# EAGLE board Daughter Card v5 (EAGLE 7.7.0)
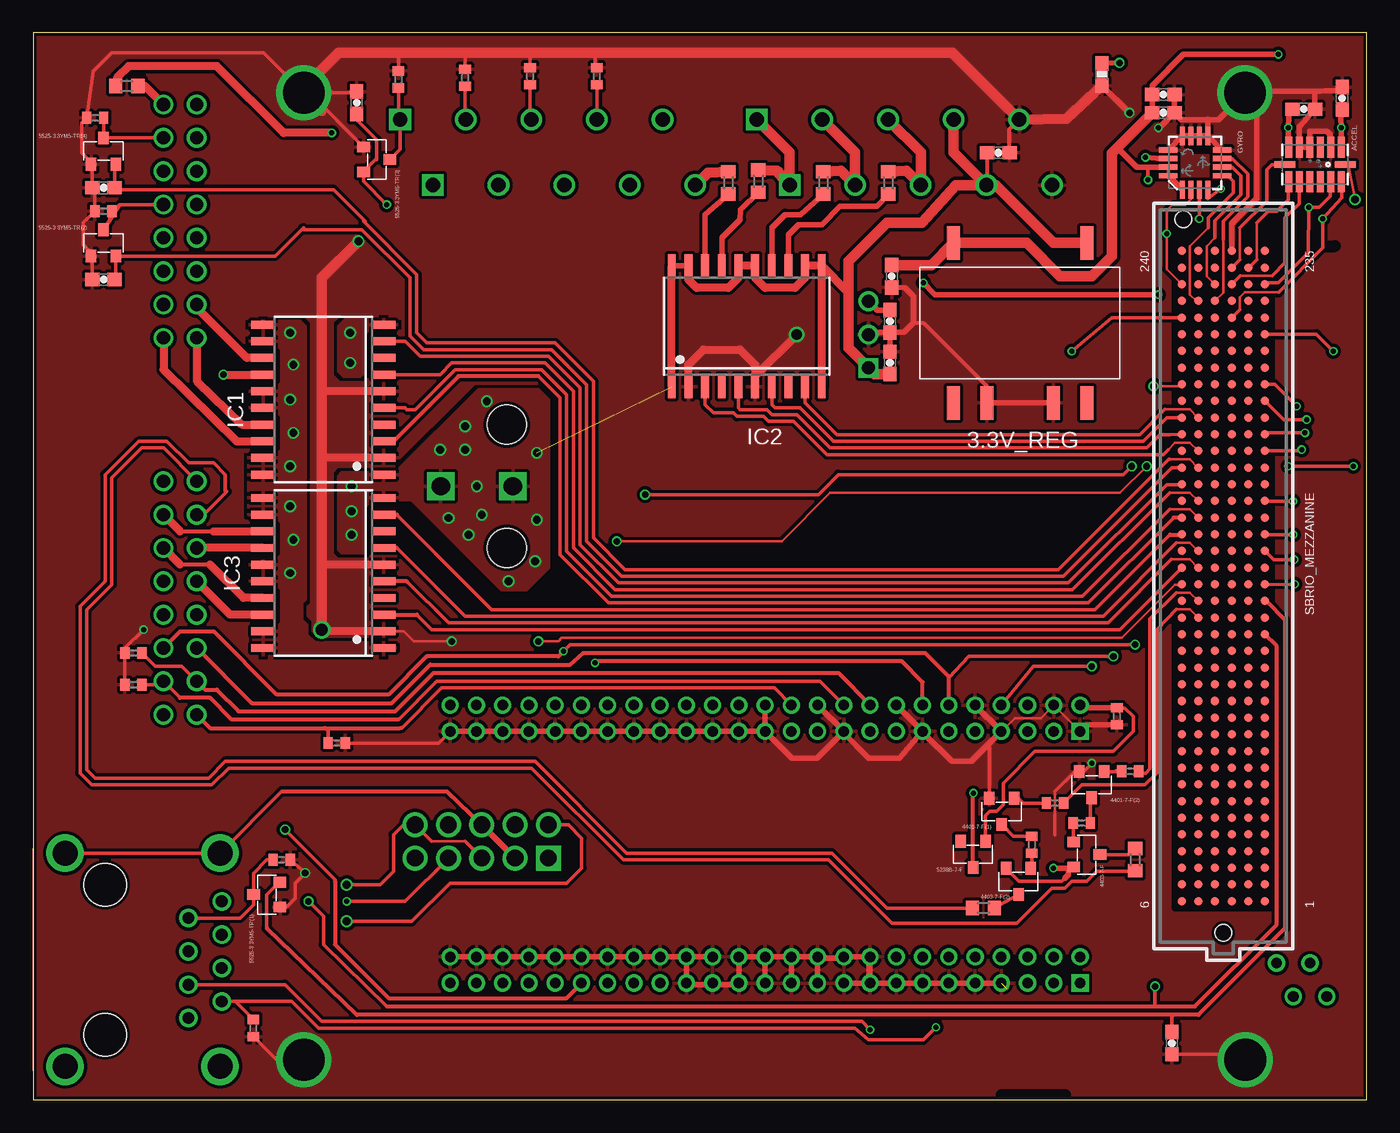
[diagram p2: board, top side]
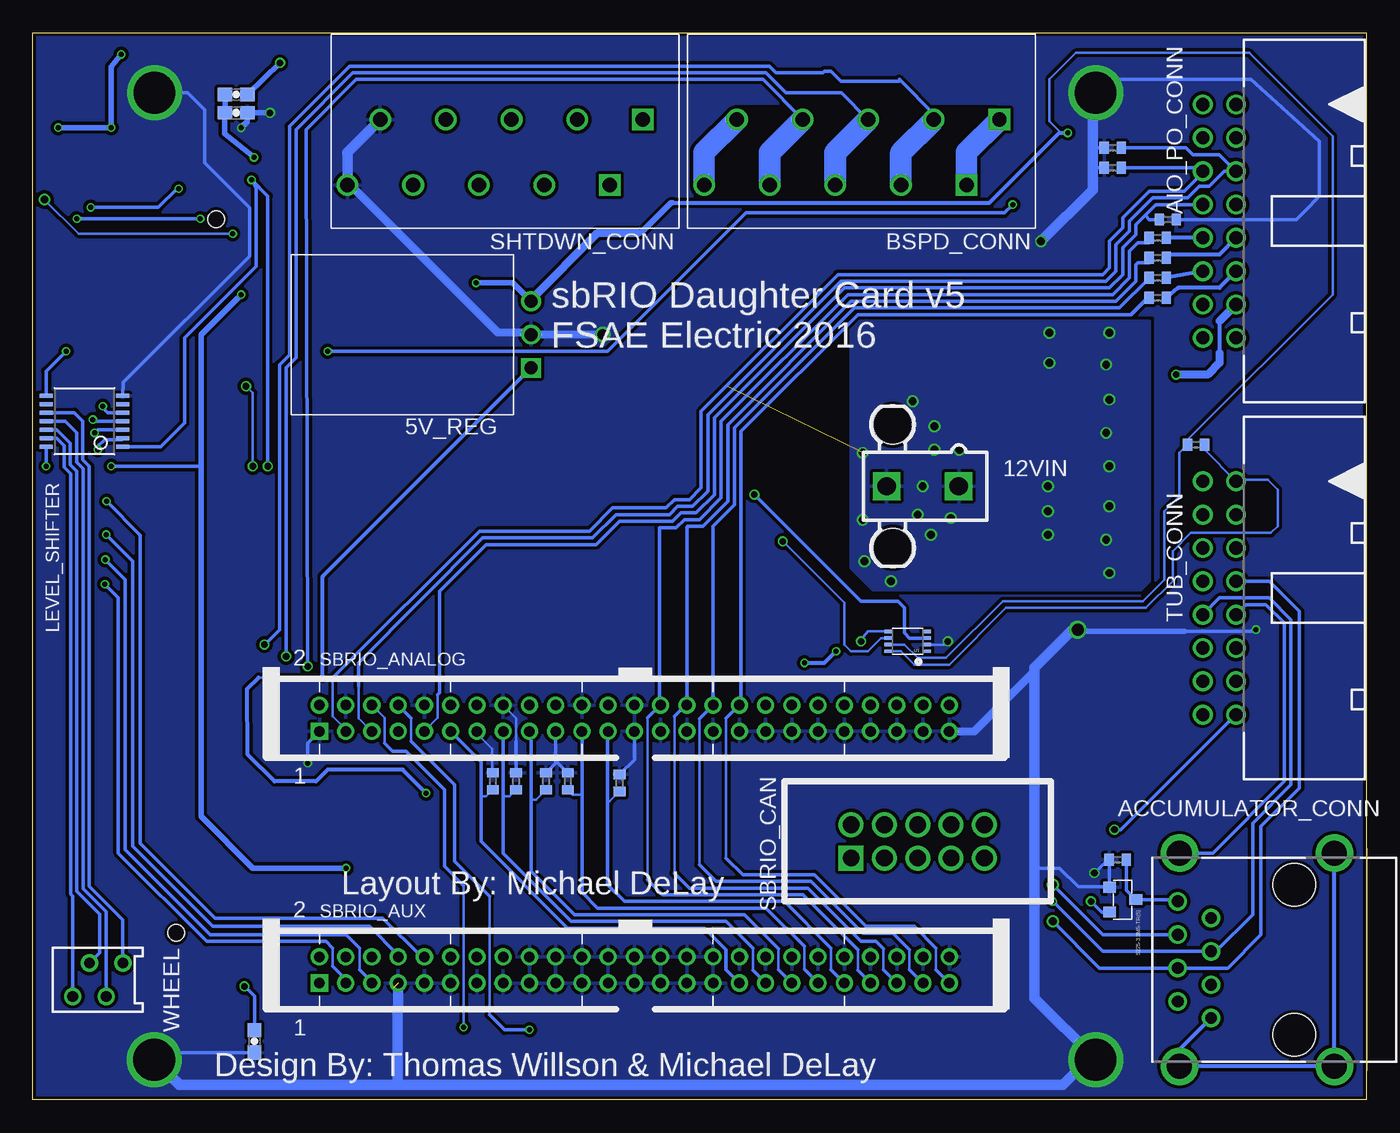
[diagram p3: board, bottom side, seen from below]

Size 101.65 x 81.28 mm. Coordinates in mm from the lower left corner, seen from the top.
Outline: 0.05,0 101.65,0 101.65,81.28 0.05,81.28 0.05,0
Copper layers (1*16): Top 0.035mm / dielectric 1.5mm / Bottom 0.035mm
Design rules "PCBFabExpress DRC": minimum track width 6mil, minimum drill 15mil, track to track 6mil, track to pad 8mil, pad to pad 8mil, via to via 8mil, smd to smd 8mil, copper to edge 10mil, drill to drill 8mil, minimum pad ring 10mil, minimum via ring 5mil, stop-mask expansion 2mil, vias tented up to drill 15mil, thermal gap 10mil
Net classes: 0 default: clearance 0.205 mm
tRestrict: area 87,14.6 to 94.4,65.2; area 65.4,29.6 to 66.3,30.6; area 73.4,27.6 to 74.3,28.5; area 55.3,29.6 to 56.3,30.6; area 59.4,29.6 to 60.4,30.6; 3 lines
bRestrict: area 67.3,27.6 to 68.2,28.5; area 73.4,27.6 to 74.3,28.5; area 61.3,27.6 to 62.3,28.5; 1 lines

## Footprints (pad centres in the part's own frame; a part is rotated, then mirrored left to right if it is on the bottom)
V78XX-1000 = smd 1 x 2.54: 1 -5.08,-6.096; 5 5.08,-6.096; 6 5.08,6.096; 7 2.54,6.096; 9 -2.54,6.096; 10 -5.08,6.096
V78XX-1500R = drill 1 square: P$1 0,2.54 | drill 1: P$2 0,0; P$3 0,-2.54
5566-2 = drill 1.4 square: 1 0,-2.75; 2 0,2.75 | hole 3: 4.7,2.29; -4.7,2.29
SOT-23-3 = smd 0.8 x 0.976: P$1 0,1; P$2 -0.95,-1; P$3 0.95,-1
LGA14 = smd 0.5 x 1.6: 1 2,1.3; 2 1.2,1.3; 3 0.4,1.3; 4 -0.4,1.3; 5 -1.2,1.3; 6 -2,1.3; 8 -2,-1.3; 9 -1.2,-1.3; 10 -0.4,-1.3; 11 0.4,-1.3; 12 1.2,-1.3; 13 2,-1.3 | smd 1.6 x 0.5: 7 -2.3,0; 14 2.3,0
RJ45-SHIELD1 = drill 0.9 pad 1.4: 1 -4.445,6.35; 2 -3.175,8.89; 3 -1.905,6.35; 4 -0.635,8.89; 5 0.635,6.35; 6 1.905,8.89; 7 3.175,6.35; 8 4.445,8.89 | drill 1.9 pad 2.5: S1 -8.128,-3.048; S2 8.128,-3.048; S3 -8.128,8.76; S4 8.128,8.76 | hole 3.251: -5.715,0; 5.715,0
PAK100/2500-5-16 = drill 1 pad 1.422: 1 -8.89,-1.27; 2 -8.89,1.27; 3 -6.35,-1.27; 4 -6.35,1.27; 5 -3.81,-1.27; 6 -3.81,1.27; 7 -1.27,-1.27; 8 -1.27,1.27; 9 1.27,-1.27; 10 1.27,1.27; 11 3.81,-1.27; 12 3.81,1.27; 13 6.35,-1.27; 14 6.35,1.27; 15 8.89,-1.27; 16 8.89,1.27
CONNECTOR_5 = drill 1.1 square: 1 0,0; 2 2.5,5 | drill 1.1: 3 5,0; 4 7.5,5; 5 10,0; 6 12.5,5; 7 15,0; 8 17.5,5; 9 20,0; 10 22.5,5
0603-CAP = smd 1.1 x 1: 1 -0.85,0; 2 0.85,0
R0603 = smd 1 x 1.1: 1 -0.85,0; 2 0.85,0
R0402 = smd 0.7 x 0.9: 1 -0.65,0; 2 0.65,0
LGA16-4X4 = smd 1.4 x 0.4: 1 -2.05,0.975; 2 -2.05,0.325; 3 -2.05,-0.325; 4 -2.05,-0.975; 9 2.05,-0.975; 10 2.05,-0.325; 11 2.05,0.325; 12 2.05,0.975 | smd 0.4 x 1.4: 5 -0.975,-2.05; 6 -0.325,-2.05; 7 0.325,-2.05; 8 0.975,-2.05; 13 0.975,2.05; 14 0.325,2.05; 15 -0.325,2.05; 16 -0.975,2.05
PG-DSO-20 = smd 0.6 x 1.8: 1 -5.715,-4.6; 2 -4.445,-4.6; 3 -3.175,-4.6; 4 -1.905,-4.6; 5 -0.635,-4.6; 6 0.635,-4.6; 7 1.905,-4.6; 8 3.175,-4.6; 9 4.445,-4.6; 10 5.715,-4.6; 11 5.715,4.6; 12 4.445,4.6; 13 3.175,4.6; 14 1.905,4.6; 15 0.635,4.6; 16 -0.635,4.6; 17 -1.905,4.6; 18 -3.175,4.6; 19 -4.445,4.6; 20 -5.715,4.6
TSSOP14 = smd 0.305 x 0.991: 1 -1.95,-2.918; 2 -1.3,-2.918; 3 -0.65,-2.918; 4 0,-2.918; 5 0.65,-2.918; 6 1.3,-2.918; 7 1.95,-2.918; 8 1.95,2.918; 9 1.3,2.918; 10 0.65,2.918; 11 0,2.918; 12 -0.65,2.918; 13 -1.3,2.918; 14 -1.95,2.918
0603-RES = smd 1.1 x 1: 1 -0.85,0; 2 0.85,0
SBRIO_J502_J503 = drill 0.8 square: P$1 0,0 | drill 0.8: P$2 0,2; P$3 2,0; P$4 2,2; P$5 4,0; P$6 4,2; P$7 6,0; P$8 6,2; P$9 8,0; P$10 8,2; P$11 10,0; P$12 10,2; P$13 12,0; P$14 12,2; P$15 14,0; P$16 14,2; P$17 16,0; P$18 16,2; P$19 18,0; P$20 18,2; P$21 20,0; P$22 20,2; P$23 22,0; P$24 22,2; P$25 24,0; P$26 24,2; P$27 26,0; P$28 26,2; P$29 28,0; P$30 28,2; P$31 30,0; P$32 30,2; P$33 32,0; P$34 32,2; P$35 34,0; P$36 34,2; P$37 36,0; P$38 36,2; P$39 38,0; P$40 38,2; P$41 40,0; P$42 40,2; P$43 42,0; P$44 42,2; P$45 44,0; P$46 44,2; P$47 46,0; P$48 46,2; P$49 48,0; P$50 48,2
SBRIO_W = drill 1.27 pad 1.778 square: P$1 -5.08,-1.27 | drill 1.27 pad 1.778: P$2 -5.08,1.27; P$3 -2.54,-1.27; P$4 -2.54,1.27; P$5 0,-1.27; P$6 0,1.27; P$7 2.54,-1.27; P$8 2.54,1.27; P$9 5.08,-1.27; P$10 5.08,1.27
SEAM-40-XX.X-XX-06-X-A = smd 0.635 x 0.635: 1 24.765,3.175; 2 24.765,1.905; 3 24.765,0.635; 4 24.765,-0.635; 5 24.765,-1.905; 6 24.765,-3.175; 7 23.495,3.175; 8 23.495,1.905; 9 23.495,0.635; 10 23.495,-0.635; 11 23.495,-1.905; 12 23.495,-3.175; 13 22.225,3.175; 14 22.225,1.905; 15 22.225,0.635; 16 22.225,-0.635; 17 22.225,-1.905; 18 22.225,-3.175; 19 20.955,3.175; 20 20.955,1.905; 21 20.955,0.635; 22 20.955,-0.635; 23 20.955,-1.905; 24 20.955,-3.175; 25 19.685,3.175; 26 19.685,1.905; 27 19.685,0.635; 28 19.685,-0.635; 29 19.685,-1.905; 30 19.685,-3.175; 31 18.415,3.175; 32 18.415,1.905; 33 18.415,0.635; 34 18.415,-0.635; 35 18.415,-1.905; 36 18.415,-3.175; 37 17.145,3.175; 38 17.145,1.905; 39 17.145,0.635; 40 17.145,-0.635; 41 17.145,-1.905; 42 17.145,-3.175; 43 15.875,3.175; 44 15.875,1.905; 45 15.875,0.635; 46 15.875,-0.635; 47 15.875,-1.905; 48 15.875,-3.175; 49 14.605,3.175; 50 14.605,1.905; 51 14.605,0.635; 52 14.605,-0.635; 53 14.605,-1.905; 54 14.605,-3.175; 55 13.335,3.175; 56 13.335,1.905; 57 13.335,0.635; 58 13.335,-0.635; 59 13.335,-1.905; 60 13.335,-3.175; 61 12.065,3.175; 62 12.065,1.905; 63 12.065,0.635; 64 12.065,-0.635; 65 12.065,-1.905; 66 12.065,-3.175; 67 10.795,3.175; 68 10.795,1.905; 69 10.795,0.635; 70 10.795,-0.635; 71 10.795,-1.905; 72 10.795,-3.175; 73 9.525,3.175; 74 9.525,1.905; 75 9.525,0.635; 76 9.525,-0.635; 77 9.525,-1.905; 78 9.525,-3.175; 79 8.255,3.175; 80 8.255,1.905; 81 8.255,0.635; 82 8.255,-0.635; 83 8.255,-1.905; 84 8.255,-3.175; 85 6.985,3.175; 86 6.985,1.905; 87 6.985,0.635; 88 6.985,-0.635; 89 6.985,-1.905; 90 6.985,-3.175; 91 5.715,3.175; 92 5.715,1.905; 93 5.715,0.635; 94 5.715,-0.635; 95 5.715,-1.905; 96 5.715,-3.175; 97 4.445,3.175; 98 4.445,1.905; 99 4.445,0.635; 100 4.445,-0.635; 101 4.445,-1.905; 102 4.445,-3.175; 103 3.175,3.175; 104 3.175,1.905; 105 3.175,0.635; 106 3.175,-0.635; 107 3.175,-1.905; 108 3.175,-3.175; 109 1.905,3.175; 110 1.905,1.905; 111 1.905,0.635; 112 1.905,-0.635; 113 1.905,-1.905; 114 1.905,-3.175; 115 0.635,3.175; 116 0.635,1.905; 117 0.635,0.635; 118 0.635,-0.635; 119 0.635,-1.905; 120 0.635,-3.175; 121 -0.635,3.175; 122 -0.635,1.905; 123 -0.635,0.635; 124 -0.635,-0.635; 125 -0.635,-1.905; 126 -0.635,-3.175; 127 -1.905,3.175; 128 -1.905,1.905; 129 -1.905,0.635; 130 -1.905,-0.635; 131 -1.905,-1.905; 132 -1.905,-3.175; 133 -3.175,3.175; 134 -3.175,1.905; 135 -3.175,0.635; 136 -3.175,-0.635; 137 -3.175,-1.905; 138 -3.175,-3.175; 139 -4.445,3.175; 140 -4.445,1.905; 141 -4.445,0.635; 142 -4.445,-0.635; 143 -4.445,-1.905; 144 -4.445,-3.175; 145 -5.715,3.175; 146 -5.715,1.905; 147 -5.715,0.635; 148 -5.715,-0.635; 149 -5.715,-1.905; 150 -5.715,-3.175; 151 -6.985,3.175; 152 -6.985,1.905; 153 -6.985,0.635; 154 -6.985,-0.635; 155 -6.985,-1.905; 156 -6.985,-3.175; 157 -8.255,3.175; 158 -8.255,1.905; 159 -8.255,0.635; 160 -8.255,-0.635; 161 -8.255,-1.905; 162 -8.255,-3.175; 163 -9.525,3.175; 164 -9.525,1.905; 165 -9.525,0.635; 166 -9.525,-0.635; 167 -9.525,-1.905; 168 -9.525,-3.175; 169 -10.795,3.175; 170 -10.795,1.905; 171 -10.795,0.635; 172 -10.795,-0.635; 173 -10.795,-1.905; 174 -10.795,-3.175; 175 -12.065,3.175; 176 -12.065,1.905; 177 -12.065,0.635; 178 -12.065,-0.635; 179 -12.065,-1.905; 180 -12.065,-3.175; 181 -13.335,3.175; 182 -13.335,1.905; 183 -13.335,0.635; 184 -13.335,-0.635; 185 -13.335,-1.905; 186 -13.335,-3.175; 187 -14.605,3.175; 188 -14.605,1.905; 189 -14.605,0.635; 190 -14.605,-0.635; 191 -14.605,-1.905; 192 -14.605,-3.175; 193 -15.875,3.175; 194 -15.875,1.905; 195 -15.875,0.635; 196 -15.875,-0.635; 197 -15.875,-1.905; 198 -15.875,-3.175; 199 -17.145,3.175; 200 -17.145,1.905; 201 -17.145,0.635; 202 -17.145,-0.635; 203 -17.145,-1.905; 204 -17.145,-3.175; 205 -18.415,3.175; 206 -18.415,1.905; 207 -18.415,0.635; 208 -18.415,-0.635; 209 -18.415,-1.905; 210 -18.415,-3.175; 211 -19.685,3.175; 212 -19.685,1.905; 213 -19.685,0.635; 214 -19.685,-0.635; 215 -19.685,-1.905; 216 -19.685,-3.175; 217 -20.955,3.175; 218 -20.955,1.905; 219 -20.955,0.635; 220 -20.955,-0.635; 221 -20.955,-1.905; 222 -20.955,-3.175; 223 -22.225,3.175; 224 -22.225,1.905; 225 -22.225,0.635; 226 -22.225,-0.635; 227 -22.225,-1.905; 228 -22.225,-3.175; 229 -23.495,3.175; 230 -23.495,1.905; 231 -23.495,0.635; 232 -23.495,-0.635; 233 -23.495,-1.905; 234 -23.495,-3.175; 235 -24.765,3.175; 236 -24.765,1.905; 237 -24.765,0.635; 238 -24.765,-0.635; 239 -24.765,-1.905; 240 -24.765,-3.175 | hole 1.27: 27.191,0; -27.191,-3.048
VFSOP-8 = smd 0.25 x 0.65: P$1 -0.75,-1.45; P$2 -0.25,-1.45; P$3 0.25,-1.45; P$4 0.75,-1.45; P$5 0.75,1.45; P$6 0.25,1.45; P$7 -0.25,1.45; P$8 -0.75,1.45
FTOP-4 = drill 0.813: 1 -1.905,-1.27; 2 -0.635,1.27; 3 0.635,-1.27; 4 1.905,1.27

## Placement (x,y rotation side)
3.3V_REG  V7803-1000  [V78XX-1000]  75.23,59.18 180 top
5V_REG  V78XX-1500  [V78XX-1500R]  63.68,58.29 180 bottom
12VIN  5566-2  [5566-2]  33.83,46.74 90 bottom
4401-7-F(1)  MMBT4401-7-F  [SOT-23-3]  73.84,21.97 180 top
4401-7-F(2)  MMBT4401-7-F  [SOT-23-3]  80.7,24 180 top
4403-7-F  MMBT4403-7-F  [SOT-23-3]  80.31,18.67 270 top
4403-7-F(2)  MMBT4403-7-F  [SOT-23-3]  75.11,16.64 180 top
5225-3.3M5-TR(5)  MIC5225-3.3YM5-TR  [SOT-23-3]  18.59,15.24 270 bottom
5238B-7-F  MMBZ5238B-7-F  [SOT-23-3]  71.65,18.7 180 top
5525-3.3YM5-TR(1)  MIC5225-3.3YM5-TR  [SOT-23-3]  17.83,15.62 90 top
5525-3.3YM5-TR(2)  MIC5225-3.3YM5-TR  [SOT-23-3]  5.38,65.28 0 top
5525-3.3YM5-TR(3)  MIC5225-3.3YM5-TR  [SOT-23-3]  26.21,71.63 270 top
5525-3.3YM5-TR(4)  MIC5225-3.3YM5-TR  [SOT-23-3]  5.38,72.26 0 top
ACCEL  ADXL345  [LGA14]  97.71,71.25 0 top
ACCUMULATOR_CONN  RJ45-6L21-S  [RJ45-SHIELD1]  5.51,10.67 90 bottom
AIO_PO_CONN  2516-5  [PAK100/2500-5-16]  11.23,66.93 270 bottom
BSPD_CONN  CONN_5  [CONNECTOR_5]  27.99,74.68 180 bottom
C5  .1uF  [0603-CAP]  86.16,76.58 0 top
C6  10uF  [0603-CAP]  86.16,75.18 0 top
C7  .1uF  [0603-CAP]  99.78,76.3 90 top
C8  1uF  [0603-CAP]  96.86,75.47 0 top
C9  22uF  [0603-CAP]  65.46,62.74 270 top
C10  10uF  [0603-CAP]  73.58,72.14 0 top
C11  10uF  [0603-CAP]  65.33,56.13 90 top
C12  22uF  [0603-CAP]  65.33,59.31 90 top
C13  470nF  [0603-CAP]  86.16,76.58 180 bottom
C14  10nF  [0603-CAP]  86.16,75.18 180 bottom
C16  1uF  [0603-CAP]  24.69,75.95 90 top
C17  1uF  [0603-CAP]  5.38,69.47 180 top
C18  1uF  [0603-CAP]  84.76,4.45 270 bottom
C19  1uF  [0603-CAP]  86.79,4.32 270 top
C20  1uF  [0603-CAP]  5.38,62.48 180 top
F1  250mA  [R0603]  65.2,69.85 90 top
F2  250mA  [R0603]  60.25,69.85 90 top
F6  250mA  [R0603]  53.01,69.85 270 top
F14  250mA  [R0603]  55.3,69.98 90 top
F15  10mA PTC  [R0402]  15.93,65.66 0 bottom
F16  0.5A PTC  [R0603]  7.16,77.22 0 top
F17  1A PTC  [R0603]  84,18.29 90 top
F18  1A PTC  [R0603]  72.44,14.61 0 top
F20  10mA PTC  [R0402]  15.93,64.14 0 bottom
F21  10mA PTC  [R0402]  15.93,62.61 0 bottom
F22  10mA PTC  [R0402]  15.93,61.09 0 bottom
GYRO  L3G4200D  [LGA16-4X4]  88.57,71.37 90 top
IC1  BTS716G  [PG-DSO-20]  22.15,53.34 90 top
IC2  BTS716G  [PG-DSO-20]  54.41,58.93 0 top
IC3  BTS716G  [PG-DSO-20]  22.15,40.13 90 top
LEVEL_SHIFTER  [TSSOP14]  97.71,51.69 90 bottom
R1  10k  [R0402]  18.97,18.29 0 top
R2  10k  [R0402]  18.97,18.29 180 bottom
R3  10k  [R0402]  4.75,74.8 180 top
R4  10k  [R0402]  27.86,77.72 90 top
R5  10k  [R0402]  5.38,67.69 180 top
R6  10k  [R0402]  19.35,70.99 0 bottom
R7  10k  [R0402]  19.35,72.52 0 bottom
R8  10k  [R0402]  15.16,67.06 180 bottom
R9  10k  [R0402]  66.6,24.26 270 bottom
R10  10k  [R0402]  64.82,24.26 270 bottom
R11  4.7k  [R0402]  79.93,21.08 180 top
R12  4.7k  [R0402]  76.12,19.43 270 top
R13  10k  [R0402]  82.6,29.21 90 top
R14  10k  [R0402]  62.53,24.26 270 bottom
R15  4.7k  [R0402]  77.9,22.61 180 top
R16  4.7k  [R0402]  83.62,25.02 180 top
R17  10k  [R0402]  60.88,24.26 270 bottom
R18  10k  [R0402]  56.95,24.13 270 bottom
R19  10k  [R0402]  32.94,77.85 270 top
R20  10k  [R0402]  7.67,34.04 0 top
R21  10k  [R0402]  7.67,31.62 0 top
R22  10k  [R0402]  23.16,27.18 180 top
R24  10k  [R0402]  16.81,5.46 90 top
R25  10k  [R0402]  42.98,77.98 270 top
R26  10k  [R0402]  37.9,77.98 270 top
R35  10K  [0603-RES]  81.46,78.11 90 top
R36  4.7k  [R0402]  13,49.91 0 bottom
SBRIO_ANALOG  SBRIO_MIO  [SBRIO_J502_J503]  79.81,28.07 0 bottom
SBRIO_AUX  SBRIO_AUX  [SBRIO_J502_J503]  79.81,8.89 0 bottom
SBRIO_CAN  SBRIO_W500  [SBRIO_W]  34.21,19.68 0 bottom
SBRIO_MEZZANINE  SBRIO_RMC  [SEAM-40-XX.X-XX-06-X-A]  90.73,39.9 270 top
SHTDWN_CONN  CONN_5  [CONNECTOR_5]  55.17,74.68 180 bottom
TUB_CONN  2516-5  [PAK100/2500-5-16]  11.23,38.23 270 bottom
U1  [VFSOP-8]  34.98,34.92 90 bottom
WHEEL  [FTOP-4]  96.7,9.14 0 bottom

## Tracks (layer width: path | path; a pad name or v marks a point on that pad's centre or on a via)
3.3V  (via drill 0.38, 0.5)
  Top 0.254: v84.98,70.07 84.98,71.07 84.13,71.05 | GYRO.15 GYRO.16 | v46.66,46.1 59.87,46.1 61.39,47.62 83.11,47.62 v83.74,48.26
  Top 0.406: GYRO.16 GYRO.1 | ACCEL.6 v95.68,74.06 95.73,74.89 C8.1 | ACCEL.1 v99.71,74.06 99.67,74.82 C7.1 | v94.92,79.63 87.68,79.63 85.31,77.25 C5.1 C6.1 83.74,73.62 82.66,72.52 84.13,71.05 GYRO.15
  Top 0.813: C9.1 68.46,63.59 3.3V_REG.5 75.74,65.28 78.28,62.74 80.7,62.74 82.22,64.26 82.22,72.1 C6.1
  Bottom 0.254: LEVEL_SHIFTER.1 91.92,49.74 90.09,51.56 90.09,58.04 84.63,63.5 84.63,69.47 v84.98,70.07 83.74,68.83 v83.74,48.26 | U1.P$3 34.84,35.17 35.23,35.56 35.23,37.47 35.74,37.97 38.53,37.97 v46.66,46.1
  Bottom 0.406: v94.92,79.63 95.68,78.7 v95.68,74.06 v99.71,74.06
5V  (via drill 0.38)
  Top 0.178: 4403-7-F.P$3 77.84,17.72 v77.77,17.65
  Top 0.254: 78.66,16.89 78.41,16.64 75.16,16.64 4403-7-F(2).P$3 | v100.63,48.26 v95.68,48.26
  Top 0.406: C12.2 64.35,60.16 5V_REG.P$3 | v85.78,61.34 68.76,61.34 v67.87,62.23 | v77.77,17.65 78.79,17.65 78.92,17.53 78.92,17.14 78.66,16.89
  Top 0.61: v22.78,73.66 19.1,73.66 14.02,78.74 7.29,78.74 6.4,77.85 6.4,77.23 F16.1
  Bottom 0.178: U1.P$7 35.23,34.67 34.21,33.66 32.05,33.66 27.74,37.97 17.07,37.97 15.42,39.62 15.42,44.83 14.27,45.97 14.27,49.29 R36.1 13.65,50.28 2.59,61.34 2.59,73.41 8.94,79.76 22.15,79.76 24.18,77.72 24.18,74.55 23.29,73.66
  Bottom 0.254: LEVEL_SHIFTER.14 v100.63,48.26 | v95.68,48.26 88.82,48.26
  Bottom 0.305: 52.88,68.33 28.75,68.33 23.42,73.66 23.29,73.66 v22.78,73.66
  Bottom 0.406: 55.55,66.04 55.3,66.04 53.01,68.33 52.88,68.33 | v77.77,17.65 84.89,17.65 88.82,21.59 88.82,48.26 88.82,58.29 v85.78,61.34 | v67.87,62.23 65.07,62.23 5V_REG.P$3
  Bottom 0.61: 5V_REG.P$3 63.68,60.96 58.6,66.04 55.55,66.04
5V_FUSED
  Top 0.61: F16.2 8.56,77.22 AIO_PO_CONN.2
5V_IO_1
  Top 0.254: TUB_CONN.3 13,44.58 14.72,46.29 | 14.72,46.29 14.78,46.35 | F17.1 84,17.4 81.08,17.4 80.31,16.64 79.17,16.64 78.66,16.13 77.65,16.13 74.98,13.46 65.46,13.46 60.63,18.29 45.01,18.29 38.02,25.27 14.91,25.27 13.64,24 4.5,24 3.61,24.89 3.61,37.59 5.51,39.5 5.51,47.62 8.05,50.16 10.21,50.16 11.86,48.51 13.77,48.51 14.66,47.62 14.66,46.35 14.72,46.29
12V  (via drill 0.38, 0.6)  (1 unrouted)
  Top 0.254: 71.62,17.48 5238B-7-F.P$1
  Top 0.305: 73.38,69.68 72.73,70.32 C10.1 | 5238B-7-F.P$1 71.65,23.34 v71.68,23.37
  Top 0.406: IC2.20 IC2.19
  Top 0.61: 62.15,57.28 62.15,61.5 IC2.11 | IC2.11 IC2.12 58.85,62.61 58.09,61.85 55.8,61.85 55.04,62.61 IC2.15 IC2.16 53.77,62.61 53.01,61.85 50.6,61.85 49.96,62.48 IC2.19 | IC2.10 IC2.11 | IC2.1 IC2.20
  Top 0.813: C11.1 64.15,55.28 5V_REG.P$1 62.15,57.28 62.15,63.88 65.07,66.8 67.74,66.8 70.36,69.68 SHTDWN_CONN.8 | SHTDWN_CONN.8 70.17,72.18 SHTDWN_CONN.7 | SHTDWN_CONN.8 73.38,69.68 77.77,65.28 3.3V_REG.1
  Bottom 0.178: 79.55,32.16 84.44,32.16
  Bottom 0.305: v71.68,23.37 73.46,25.15 79.17,25.15 80.06,24.26 83.24,24.26 85.27,26.29 85.33,31.3 84.44,32.16 | 79.55,32.16 79.55,39.88 5V_REG.P$1
  other vias: 19.61,58.42 19.86,56.01 19.61,53.34 19.86,50.8 19.61,48.26 19.61,45.21 19.86,42.67 19.61,40.13 24.31,44.83 24.31,43.05 24.31,46.74 24.18,56.13 24.18,58.42 32.94,49.53 31.04,49.53 32.94,51.31 34.59,53.21 38.4,49.28 33.83,46.74 31.67,44.32 33.2,43.05 34.21,44.58 38.4,44.2 38.28,41.02 36.25,39.5
  pour Bottom: 16.56,59.31 38.66,59.31 39.29,58.67 39.29,40.51 37.64,38.86 17.2,38.86 16.56,39.5
  pour Top: 16.56,59.31 20.37,59.31 20.75,58.93 20.75,38.1 20.5,37.85 20.5,36.58 20.88,36.2 20.88,35.43 21.51,34.8 27.36,34.8 27.61,34.54 27.61,34.04 27.48,33.91 17.07,33.91 16.81,34.16 16.81,35.81 18.47,35.81 18.97,36.32 18.97,38.86 18.47,39.37 16.69,39.37 16.56,39.5 16.56,40.89 16.69,41.02 18.47,41.02 18.97,41.53 18.97,43.94 18.47,44.45 16.56,44.45 16.43,44.58 16.43,49.02 18.47,49.02 18.97,49.53 18.97,52.07 18.47,52.58 16.69,52.58 16.56,52.7 16.56,53.98 16.69,54.1 18.47,54.1 18.97,54.61 18.97,57.15 18.47,57.66 16.69,57.66 16.56,57.78
  pour Top: 23.55,47.75 23.29,47.5 23.29,41.91 23.55,41.66 25.2,41.66 25.32,41.78 25.32,45.21 25.83,45.72 28.88,45.72 35.74,38.86 37.64,38.86 39.29,40.51 39.29,53.34 38.53,54.1 33.96,54.1 27.61,47.75
  pour Top: 27.61,59.44 23.8,59.44 23.29,58.93 23.29,55.5 23.67,55.12 24.94,55.12 25.2,55.37 25.2,58.29 25.83,58.93 27.74,58.93 27.74,59.31
ACCUMULATOR_FANS
  Top 0.61: AIO_PO_CONN.16 9.96,55.63 15.54,50.16 IC1.18
AI1  (via drill 0.38)
  Top 0.254: v68.82,5.52 67.87,4.57 63.68,4.57 62.66,5.46 21.77,5.46 19.74,7.49 ACCUMULATOR_CONN.2 15.43,7.49 R24.2
  Bottom 0.178: 74.85,27.18 74.85,29.11 SBRIO_ANALOG.P$6 | 68.82,16.32 v68.82,5.52
  Bottom 0.254: 68.82,16.32 70.28,17.78 70.28,23.62 73.2,26.54 74.22,26.54 74.85,27.18
AI2  (via drill 0.38, 0.5)
  Top 0.254: ACCUMULATOR_CONN.3 19.23,8.76 22.02,5.97 63.17,5.97 v63.8,5.33 | v80.7,33.02 76.25,33.02 SBRIO_ANALOG.P$8 | R25.2 42.99,77.31 BSPD_CONN.7
  Bottom 0.178: 72.82,29.08 72.82,27.3 | 66.85,6.48 66.85,15.49
  Bottom 0.254: v63.8,5.33 65.71,5.33 66.85,6.48 | 66.85,15.49 69.52,18.16 69.52,24 72.82,27.3 | 72.82,29.08 SBRIO_ANALOG.P$8 | BSPD_CONN.8 45.49,72.03 42.98,74.55 42.98,74.68 46.02,77.72 77.01,77.72 80.82,73.91 v80.7,33.02
  Bottom 1.676: BSPD_CONN.8 45.49,72.18 BSPD_CONN.7
AI7
  Top 0.254: 27.99,28.32 28.12,28.32 31.17,31.37 56.5,31.37 SBRIO_ANALOG.P$24 | R22.2 22.51,28.08 22.28,28.32
  Top 0.305: TUB_CONN.15 13.51,28.32 22.28,28.32 27.99,28.32 | 57.81,30.13 SBRIO_ANALOG.P$24
AI8
  Bottom 0.178: 78.79,32.13 78.79,29.21
  Bottom 0.203: SBRIO_ANALOG.P$3 77.81,28.23 78.79,29.21
  Bottom 0.254: 78.79,32.13 67.61,43.31 59.23,43.31 57.45,45.09 53.39,45.09 52.76,45.72 51.61,45.72 50.72,46.61 50.72,52.45 40.31,62.87 20.12,62.87 19.61,63.37 19.61,65.41 18.59,66.42 18.59,67.18 16.56,69.22 13.89,69.22 12.5,70.61 AIO_PO_CONN.5 12.75,70.99 R6.2
AI9
  Bottom 0.178: 76.82,31.5 76.82,29.08
  Bottom 0.203: SBRIO_ANALOG.P$5 75.87,28.07 76.82,29.08
  Bottom 0.254: 76.82,31.5 76.82,33.27 67.36,42.8 58.98,42.8 57.2,44.58 53.14,44.58 52.5,45.21 51.36,45.21 50.22,46.35 50.22,52.2 40.06,62.36 19.86,62.36 19.1,63.12 19.1,65.15 18.08,66.17 18.08,66.93 16.31,68.71 13.64,68.71 12.75,69.6 11.99,69.6 10.85,70.74 AIO_PO_CONN.6 11.23,72.01 13.26,72.01 13.77,72.52 R7.2
AI10
  Bottom 0.203: 70.79,30.86 70.79,29.08 SBRIO_ANALOG.P$9
  Bottom 0.254: 70.79,30.86 70.66,30.99 70.66,38.73 67.11,42.29 58.72,42.29 56.95,44.07 52.88,44.07 52.25,44.7 51.1,44.7 49.71,46.1 49.71,51.94 39.8,61.85 19.61,61.85 18.59,62.87 18.59,64.9 17.58,65.91 17.58,66.67 16.88,67.37 | 16.88,67.37 16.05,68.2 AIO_PO_CONN.7 | R8.2 16.56,67.06 16.88,67.37
AI11
  Bottom 0.178: R9.2 67.09,23.11 67.49,23.11
  Bottom 0.254: SBRIO_AUX.P$33 48.82,9.9 48.82,11.43 50.47,13.08 60.88,13.08 67.49,19.68 67.49,23.11 67.49,25.75 SBRIO_ANALOG.P$11
AI12
  Bottom 0.178: 46.79,11.56 46.79,9.87 | R10.2 65.31,23.11 65.81,23.11
  Bottom 0.254: SBRIO_ANALOG.P$15 65.81,23.11 65.81,18.77 60.63,13.59 48.82,13.59 46.79,11.56 | 46.79,9.87 SBRIO_AUX.P$35
AI13
  Bottom 0.178: 44.82,11.49 44.82,9.9 | R14.2 63.28,22.86 63.68,22.86
  Bottom 0.254: SBRIO_ANALOG.P$17 63.68,28.07 63.68,22.86 63.68,17.4 60.38,14.1 47.42,14.1 44.82,11.49 | 44.82,9.9 SBRIO_AUX.P$37
AI15
  Bottom 0.178: 40.82,11.56 40.82,9.9 | R18.2 57.69,22.73 57.84,22.73
  Bottom 0.254: SBRIO_ANALOG.P$23 57.81,27.97 57.84,27.94 57.84,22.73 57.84,16.38 56.57,15.11 44.37,15.11 40.82,11.56 | 40.82,9.9 SBRIO_AUX.P$41
AMS_OK_IN
  Top 0.254: R1.1 17.83,18.29 16.81,17.27 16.81,15.64 5525-3.3YM5-TR(1).P$1 16.83,14.88 15.8,13.84 ACCUMULATOR_CONN.7
AMS_OUT
  Top 0.305: 13.51,40.77 11.23,40.77
  Top 0.61: IC3.17 16.05,38.23 13.51,40.77 | 11.23,40.77 TUB_CONN.6
AO0
  Bottom 0.178: 54.79,29.09 54.79,16.76 | 38.79,11.43 38.79,9.87
  Bottom 0.254: 54.79,29.09 SBRIO_ANALOG.P$28 53.9,30.16 53.9,43.56 52.63,43.56 51.99,44.2 50.85,44.2 49.2,45.85 49.2,51.69 39.55,61.34 19.35,61.34 18.08,62.61 18.08,64.64 17.45,65.28 16.56,65.28 F15.1 | 54.79,16.76 53.64,15.62 42.98,15.62 38.79,11.43 | 38.79,9.87 SBRIO_AUX.P$43
AO1
  Bottom 0.178: 52.76,29.21 52.76,17.27 | 36.82,11.49 36.82,9.9
  Bottom 0.254: 52.76,29.21 51.9,30.07 SBRIO_ANALOG.P$30 51.81,43.62 51.74,43.69 50.6,43.69 48.69,45.59 48.69,51.44 39.29,60.83 19.1,60.83 17.58,62.36 17.58,63.63 17.45,63.75 16.56,63.75 F20.1 | 52.76,17.27 51.61,16.13 42.6,16.13 38.53,12.06 37.39,12.06 36.82,11.49 | 36.82,9.9 SBRIO_AUX.P$45
AO2
  Bottom 0.178: 50.85,17.91 50.85,29.02 | 34.85,11.43 34.85,9.91
  Bottom 0.254: SBRIO_AUX.P$47 33.83,8.89 34.85,9.91 | 34.85,11.43 36.12,12.7 38.4,12.7 42.34,16.64 49.58,16.64 50.85,17.91 | 50.85,29.02 SBRIO_ANALOG.P$32 49.83,30.09 49.83,43.69 48.18,45.34 48.18,51.18 39.04,60.33 18.85,60.33 16.58,62.6 F21.1
AO3
  Bottom 0.178: 48.82,29.08 48.82,18.41 | 32.82,11.56 32.82,9.9
  Bottom 0.254: 48.82,29.08 47.83,30.07 SBRIO_ANALOG.P$34 47.68,30.2 47.68,50.93 38.79,59.82 17.96,59.82 | 48.82,18.41 47.55,17.14 42.09,17.14 38.15,13.21 34.47,13.21 32.82,11.56 | 32.82,9.9 SBRIO_AUX.P$49
  Bottom 0.305: F22.1 16.69,61.09 17.96,59.82
BRAKE_PRESS_IN_1  (via drill 0.5)
  Top 0.254: v82.35,33.78 71.33,33.78 69.81,32.13 | R26.2 37.9,74.77 BSPD_CONN.5
  Top 0.305: TUB_CONN.11 16.69,30.23 27.36,30.23 30.28,33.15 40.94,33.15 41.96,34.04 68,34.04 69.81,32.23 69.81,32.13 SBRIO_ANALOG.P$12
  Bottom 0.254: v82.35,33.78 82.35,55.75 81.58,56.52 81.58,73.91 77.27,78.23 45.77,78.23 44.25,76.71 40.02,76.71 BSPD_CONN.5
  Bottom 1.676: BSPD_CONN.6 40.49,72.18 BSPD_CONN.5
BRAKE_PRESS_IN_2  (via drill 0.38, 0.5)
  Top 0.254: v40.44,34.16 40.94,34.67 v84,34.67 | BSPD_CONN.3 32.94,74.72 R19.2
  Top 0.305: TUB_CONN.12 11.23,35.69 13.77,35.69 18.59,30.86 27.1,30.86 30.02,33.78 40.06,33.78 v40.44,34.16 | SBRIO_ANALOG.P$14 67.81,31.81 66.22,33.4 42.98,33.4 v42.85,33.27
  Bottom 0.254: BSPD_CONN.4 35.49,72 32.94,74.55 32.94,75.06 35.55,77.66 | 35.55,77.66 35.61,77.72 | v84,34.67 82.85,35.81 82.85,56.01 82.09,56.77 82.09,74.17 77.52,78.74 45.52,78.74 45.01,78.23 41.45,78.23 41.33,78.36 40.82,78.36 40.06,77.6 35.61,77.6 35.55,77.66
  Bottom 0.305: v42.85,33.27 41.33,33.27 v40.44,34.16
  Bottom 1.676: BSPD_CONN.4 35.49,72.18 BSPD_CONN.3
BSPD_OK_IN
  Top 0.254: R4.1 27.86,74.8 BSPD_CONN.1 27.99,72.41 5525-3.3YM5-TR(3).P$1
  Bottom 1.651: BSPD_CONN.1 30.49,72.18 BSPD_CONN.2
BSPD_OUT
  Top 0.305: 11.23,43.31 13.77,43.31
  Top 0.61: 13.77,43.31 IC3.13 | 11.23,43.31 TUB_CONN.4
BUZZER_OUT
  Top 0.61: IC3.18 15.04,36.96 TUB_CONN.7
CAN_GND
  Top 0.254: 18.97,23.5 ACCUMULATOR_CONN.S4 ACCUMULATOR_CONN.S2
  Top 0.305: 18.97,23.5 31.55,23.5 SBRIO_CAN.P$6
  Top 0.406: SBRIO_CAN.P$6 SBRIO_CAN.P$3
  Bottom 0.254: TUB_CONN.10 9.19,37.72 7.67,37.72 6.27,36.32 6.27,24.26 11.73,18.8 ACCUMULATOR_CONN.S4
  Bottom 0.305: ACCUMULATOR_CONN.S2 ACCUMULATOR_CONN.S1 ACCUMULATOR_CONN.S3 14.27,3.81 ACCUMULATOR_CONN.1
CAN_H  (via drill 0.38)
  Top 0.254: v23.93,15.11 28.37,15.11 SBRIO_CAN.P$7
  Bottom 0.254: v23.93,15.11 20.12,11.3 ACCUMULATOR_CONN.5 11.48,11.3 8.69,14.1 8.69,21.08 5.77,24 5.77,36.58 7.42,38.23 11.23,38.23 TUB_CONN.9
CAN_L  (via drill 0.6)
  Top 0.254: v23.93,13.59 28.88,13.59 31.8,16.51 40.69,16.51 41.83,17.65 41.83,19.94 40.82,20.95 SBRIO_CAN.P$2
  Bottom 0.254: v23.93,13.59 20.37,10.03 ACCUMULATOR_CONN.4 10.59,10.03 8.05,12.57 8.05,20.83 5.13,23.75 5.13,37.21 7.42,39.5 TUB_CONN.8
DC_DC_DISABLE
  Top 0.254: F18.1 65.07,14.61 60.88,18.8 45.26,18.8 38.28,25.78 14.66,25.78 13.39,24.51 4.75,24.51 4.11,25.15 4.11,37.34 6.02,39.24 6.02,47.37 8.31,49.66 9.96,49.66 TUB_CONN.1
DIO0  (via drill 0.38, 0.6)
  Top 0.178: GYRO.2 88.24,68.6 87.84,68.17 86.86,68.17 86.41,67.75 v86.41,65.98 86.41,63.27 SBRIO_MEZZANINE.228 | ACCEL.14 100.25,71.25 v100.76,68.58
  Bottom 0.178: v100.76,68.58 98.16,65.98 v86.41,65.98
DIO1  (via drill 0.38)
  Top 0.254: SBRIO_MEZZANINE.216 82.24,59.59 v79.17,57.02 | 26.93,68.2 v26.97,68.2 25.21,69.96 5525-3.3YM5-TR(3).P$3 25.2,70.69 25.2,70.74 26.09,71.63 26.21,71.63 26.21,73.15 24.69,74.68 C16.1
  Bottom 0.254: v79.17,57.02 57.84,57.02 47.29,67.56 27.61,67.56 v26.97,68.2
DIO4  (via drill 0.5)
  Top 0.178: v44.5,42.55 57.07,42.55 60.76,46.23 82.85,46.23 v84.89,48.26 | v85.39,54.36 87.4,54.36 SBRIO_MEZZANINE.192
  Bottom 0.178: U1.P$6 37.01,35.17 38.02,34.16 39.29,34.16 39.8,34.67 39.8,37.85 v44.5,42.55 | v84.89,48.26 84.89,53.85 v85.39,54.36
DIO5
  Top 0.254: SBRIO_MEZZANINE.180 86.66,51.94 86.41,51.94 84.63,50.16 61.01,50.16 58.47,52.7 56.57,52.7 56.31,52.96 IC2.7
DIO6
  Top 0.254: SBRIO_MEZZANINE.174 86.66,50.67 85.9,50.67 84.89,49.66 60.76,49.66 58.22,52.2 56.31,52.2 55.93,52.58 53.9,52.58 53.77,52.7 IC2.5
DIO7
  Top 0.254: 87.53,48.13 86.79,48.13 78.54,39.88 44.88,39.88 42.21,42.55 42.21,54.48 39.55,57.15 29.77,57.15 28.75,58.17 28.75,62.61 25.07,66.29 20.62,66.29 20.56,66.36 | 20.62,66.42 20.56,66.36 | 20.56,66.36 18.47,64.26 6.35,64.26 5525-3.3YM5-TR(2).P$3 6.33,62.58 C20.1
  Top 0.305: 87.53,48.13 SBRIO_MEZZANINE.162
DIO8
  Top 0.254: SBRIO_MEZZANINE.156 87.53,46.86 86.41,46.86 78.92,39.37 44.63,39.37 41.71,42.29 41.71,54.23 39.29,56.64 29.51,56.64 28.37,57.78 IC1.9
DIO9
  Top 0.254: 86.94,44.35 80.44,37.85 43.87,37.85 40.18,41.53 40.18,53.47 38.53,55.12
  Top 0.305: SBRIO_MEZZANINE.144 86.94,44.35 | 38.53,55.12 32.44,55.12 27.48,50.16 IC1.3
DIO10
  Top 0.254: 27.74,44.58 34.98,37.34 80.95,37.34 86.66,43.05
  Top 0.305: IC3.9 27.74,44.58 | 86.66,43.05 87.53,43.05 SBRIO_MEZZANINE.138
DIO11
  Top 0.254: SBRIO_MEZZANINE.126 82.83,35.81 30.4,35.81 29.26,36.96
  Top 0.305: IC3.3 29.26,36.96
DIO12  (via drill 0.5)
  Top 0.178: v38.53,34.92 40.06,34.92 40.31,35.18 82.98,35.18 87.05,39.24 87.53,39.24 SBRIO_MEZZANINE.120
  Bottom 0.178: U1.P$5 36.44,35.69 38.02,35.69 38.53,35.05 v38.53,34.92
DIO16
  Top 0.178: 92,66.42 92,64.03 91.97,64.01
  Top 0.254: SBRIO_MEZZANINE.231 91.97,64.01 | 92,66.42 94.03,68.45 94.03,70.87 94.41,71.25 ACCEL.7
DIO17
  Top 0.178: 92,62.77 94.44,62.77
  Top 0.254: ACCEL.9 96.51,68.27 95.43,67.18 95.43,63.75 94.44,62.77 | 92,62.77 SBRIO_MEZZANINE.225
DIO18  (via drill 0.38)
  Top 0.178: 92,60.2 92,61.15 92.35,61.5 94.95,61.5
  Top 0.254: GYRO.3 88.89,68.51 v88.89,67.12 | ACCEL.13 99.75,70.11 99.75,68.71 v98.28,67.12 98.32,64.9 94.95,61.5 | SBRIO_MEZZANINE.213 91.39,59.59 92,60.2
  Bottom 0.254: v88.89,67.12 v98.28,67.12
DIO32
  Top 0.178: SBRIO_MEZZANINE.221 88.67,60.86 88.19,61.34 88.19,65.02 89.59,66.42
  Top 0.254: 89.59,66.42 89.59,67.18 91.49,69.09 91.49,69.98 91.11,70.36 90.46,70.36 GYRO.5
DIO37
  Top 0.178: SBRIO_MEZZANINE.179 88.8,51.97 88.16,52.61 86.28,52.61
  Top 0.254: 86.28,52.61 84.38,50.67 61.26,50.67 58.85,53.09 IC2.9
DIO38
  Top 0.178: 87.01,50.07 88.18,50.07
  Top 0.203: 86.54,49.53 87.01,50.07 | 88.18,50.07 SBRIO_MEZZANINE.167
  Top 0.254: IC2.3 51.23,52.96 51.87,52.32 53.39,52.32 53.64,52.07 55.68,52.07 56.06,51.69 57.96,51.69 60.5,49.15 86.16,49.15 86.54,49.53
DIO39
  Top 0.178: 86.63,48.8 88.16,48.8
  Top 0.203: SBRIO_MEZZANINE.161 88.8,48.16 88.16,48.8
  Top 0.254: 86.63,48.8 86.57,48.8 78.16,40.39 45.14,40.39 42.72,42.8 42.72,54.74 39.8,57.66 30.02,57.66 29.26,58.42 29.26,62.87 25.2,66.93 25.26,66.99 | 25.32,66.93 25.26,66.99 | 25.26,66.99 22.91,69.34 6.36,69.34 C17.1 6.23,71.16 5525-3.3YM5-TR(4).P$3
DIO40
  Top 0.178: 86.63,46.26 88.18,46.26
  Top 0.203: 88.18,46.26 SBRIO_MEZZANINE.149
  Top 0.254: 86.63,46.26 79.23,38.86 44.37,38.86 41.2,42.04 41.2,53.98 39.04,56.13 31.93,56.13 31.04,55.24 IC1.7
  Top 0.305: IC1.7 27.48,55.24
DIO41
  Top 0.178: 86.63,44.99 88.18,44.99
  Top 0.203: 88.18,44.99 SBRIO_MEZZANINE.143
  Top 0.254: 86.63,44.99 80,38.35 44.12,38.35 40.69,41.78 40.69,53.72 38.79,55.63 32.18,55.63 29.13,52.58 28.5,52.58 28.37,52.7 IC1.5
  Top 0.305: IC1.5 27.48,52.7
DIO42
  Top 0.178: 87.14,42.45 88.16,42.45
  Top 0.203: SBRIO_MEZZANINE.131 88.8,41.81 88.16,42.45
  Top 0.254: 27.74,42.04 32.94,36.83 81.58,36.83 87.14,42.45
  Top 0.305: 27.74,42.04 IC3.7
DIO43
  Top 0.178: 86.76,41.18 88.16,41.18
  Top 0.203: SBRIO_MEZZANINE.125 88.8,40.54 88.16,41.18
  Top 0.254: 28.5,39.5 31.67,36.32 81.97,36.32 86.76,41.18
  Top 0.305: 28.5,39.5 IC3.5
DIO44
  Top 0.178: 87.14,38.64 88.18,38.64
  Top 0.203: SBRIO_MEZZANINE.113 88.18,38.64
  Top 0.254: 87.14,38.64 85.14,36.64 85.14,25.21 84.82,24.89 84.39,24.89 R16.1
DIO45
  Top 0.178: 87.14,37.37 88.18,37.37
  Top 0.203: 88.18,37.37 SBRIO_MEZZANINE.107
  Top 0.254: R15.1 79.93,24 84.76,24 85.65,24.89 85.65,35.81 87.14,37.37
DIO48
  Top 0.178: 93.27,66.8 93.27,64.01
  Top 0.254: SBRIO_MEZZANINE.230 92.66,63.4 93.27,64.01 | 93.27,66.8 94.16,67.69 94.79,67.69 95.68,68.58 95.68,70.11 ACCEL.8
DIO64
  Top 0.178: SBRIO_MEZZANINE.226 90.07,62.13 89.46,62.74 89.46,65.02 90.09,65.66
  Top 0.254: 90.09,65.66 90.09,66.96 92.06,68.96 92.06,70.39 91.43,71.03 90.48,70.99 GYRO.6
DIO65
  Top 0.178: 90.73,65.53 90.73,61.49 SBRIO_MEZZANINE.220
  Top 0.254: GYRO.7 91.42,71.7 92.6,70.55 92.6,68.8 90.73,66.93 90.73,65.53
DIO81  (via drill 0.38)
  Top 0.254: GYRO.4 89.54,68.62 v90.54,69.41 | ACCEL.12 98.86,70.09 98.86,68.83 98.03,67.98 v97.24,67.98 97.21,64.52 94.92,62.23 94.01,62.23 SBRIO_MEZZANINE.223
  Bottom 0.254: v90.54,69.41 90.67,69.41 92.09,67.98 v97.24,67.98
DIO83  (via drill 0.38)
  Top 0.254: SBRIO_MEZZANINE.205 97.82,58.32 v99.11,57.02
  Bottom 0.254: v99.11,57.02 100.63,55.5 LEVEL_SHIFTER.8
DIO85  (via drill 0.38)
  Top 0.254: SBRIO_MEZZANINE.187 94.64,54.51 v96.32,52.83
  Bottom 0.254: v96.32,52.83 96.32,52.7 95.94,52.32 94.81,52.32 LEVEL_SHIFTER.5
DIO86  (via drill 0.38)
  Top 0.254: v97.08,51.82 95.33,51.82 SBRIO_MEZZANINE.181
  Bottom 0.254: LEVEL_SHIFTER.4 96.95,51.69 v97.08,51.82
DIO87  (via drill 0.38)
  Top 0.254: v96.95,50.8 94.01,50.8 SBRIO_MEZZANINE.169
  Bottom 0.254: LEVEL_SHIFTER.3 96.71,51.04 v96.95,50.8
DIO88  (via drill 0.38)
  Top 0.254: SBRIO_MEZZANINE.163 96.6,49.43 v96.7,49.53
  Bottom 0.254: v96.7,49.53 96.7,49.78 96.19,50.29 94.89,50.29 LEVEL_SHIFTER.2
DIO90  (via drill 0.38)
  Top 0.254: v96.03,45.59 93.93,45.59 SBRIO_MEZZANINE.145
  Bottom 0.254: SBRIO_AUX.P$10 72.03,10.89 74.98,13.84 87.74,13.84 93.46,19.56 93.46,43.02 v96.03,45.59
DIO91  (via drill 0.38)
  Top 0.254: v96.06,43.05 93.93,43.05 SBRIO_MEZZANINE.133
  Bottom 0.254: SBRIO_AUX.P$8 73.81,11.02 76,13.21 87.93,13.21 94.03,19.3 94.03,41.02 v96.06,43.05
DIO92  (via drill 0.38)
  Top 0.254: v96.13,41.15 94.56,41.15 SBRIO_MEZZANINE.127
  Bottom 0.178: 76.76,11.56 76.76,9.91
  Bottom 0.254: SBRIO_AUX.P$5 75.81,8.95 76.76,9.91 | 76.76,11.56 77.77,12.57 88.13,12.57 94.6,19.05 94.6,39.62 v96.13,41.15
DIO93  (via drill 0.38)
  Top 0.254: v96.16,39.27 93.93,39.24 SBRIO_MEZZANINE.115
  Bottom 0.178: 78.79,10.16 78.79,11.56
  Bottom 0.254: SBRIO_AUX.P$3 77.81,9.18 78.79,10.16 | 78.79,11.56 79.3,12.06 88.41,12.06 95.14,18.8 95.14,38.26 v96.16,39.27
DIO94
  Top 0.254: 5525-3.3YM5-TR(1).P$3 18.78,16.57 17.83,15.62 17.83,13.08 | C19.1 86.79,6.35 86.92,6.48
  Top 0.305: SBRIO_MEZZANINE.109 94.01,38 95.43,36.58 95.43,13.08 88.82,6.48 86.92,6.48 24.69,6.48 17.83,13.08
DIO95  (via drill 0.5)
  Top 0.254: v21.01,15.11 22.15,13.97 22.15,11.81 26.97,7.11 | v85.52,8.64 85.52,7.11
  Top 0.305: 26.97,7.11 85.52,7.11 88.57,7.11 94.79,13.34 94.79,34.57 SBRIO_MEZZANINE.97
  Bottom 0.254: 5225-3.3M5-TR(5).P$3 20.18,14.29 v21.01,15.11 | C18.1 84.76,7.87 v85.52,8.64
E-STOP_OK
  Top 0.254: AIO_PO_CONN.4 5.4,73.28 5525-3.3YM5-TR(4).P$1 5.4,73.28 R3.1
GND  (via drill 0.38, 0.5, 0.6, 0.8, 0.9, 3.17 pad 3.81)  (1 unrouted)
  Top 0.178: 77.9,23.5 77.9,21.72 | v31.93,34.92 29.01,34.92 28.24,35.69 IC3.2
  Top 0.203: SBRIO_ANALOG.P$7 73.84,28.07 74.85,29.08 76.82,29.08 SBRIO_ANALOG.P$4 SBRIO_ANALOG.P$1
  Top 0.254: 4401-7-F(1).P$3 72.89,27.15 SBRIO_ANALOG.P$7 | 77.9,23.5 79.41,25 4401-7-F(2).P$3 80.04,25 v80.7,25.65 | 77.9,21.72 77.9,20.21 | 74.21,8.49 74.23,8.49 | R4.2 27.86,79.5 28.12,79.76 | C16.2 24.27,76.71 21.89,76.71 | 5525-3.3YM5-TR(3).P$2 21.08,76.71 v20.65,76.71 17.6,79.76 6.02,79.76 4.61,78.34 R3.2 3.73,74.44 3.73,72.14 4.43,71.44 5525-3.3YM5-TR(4).P$2 4.53,71.16 C17.2 4.73,69.27 R5.2 3.86,66.82 3.86,65.15 4.43,64.58 5525-3.3YM5-TR(2).P$2 4.53,64.18 C20.2 | 63.68,26.04 63.68,26.16 61.77,28.07 61.77,27.94 59.87,26.04 57.96,26.04 | 57.84,26.04 SBRIO_ANALOG.P$25 SBRIO_ANALOG.P$49 | SBRIO_ANALOG.P$49 | R1.2 20.75,17.29 v20.75,17.27 19.99,16.51 19.99,15.37 19.29,14.67 5525-3.3YM5-TR(1).P$2 | C19.2 91.98,3.47 v92.4,3.05 | R19.1 32.94,79.38 33.32,79.76 | R26.1 37.9,79.76 | R25.1 42.85,78.75 42.85,79.76 | R24.1 18.58,3.05 v20.65,3.05 | R22.1 30.92,27.18 SBRIO_ANALOG.P$49 | v8.43,35.81 7.02,34.4 R20.1 R21.1
  Top 0.305: 67.11,59.18 67.87,59.18 72.69,54.36 3.3V_REG.7 | C10.2 74.43,73.94 SHTDWN_CONN.9
  Top 0.406: C11.2 C12.1 | 3.3V_REG.7 3.3V_REG.9 | R13.1 80.3,28.56 SBRIO_ANALOG.P$1 | v83.58,75.18 R35.1 | 98.51,76.85 97.68,76.83 C8.2 96.51,74.12 ACCEL.5 ACCEL.4 97.31,73.79 98.6,73.79 98.86,73.53 98.86,72.4 ACCEL.2 | 98.51,76.85 98.02,76.83 92.51,76.83 | 92.51,76.83 v92.38,76.71 90.35,74.68 | 90.35,74.68 89.54,74.7 GYRO.9 | GYRO.9 GYRO.10 GYRO.11 GYRO.12 GYRO.13 | C6.2 87.51,74.68 90.35,74.68 | C5.2 C6.2 | v85.78,74.04 85.86,74.04 C6.2 | 92.51,76.83 93.27,75.95 93.27,68.67 91.36,66.77 | 91.36,66.77 91.49,66.8 | GYRO.8 GYRO.9 | C7.2 99.63,76.86 98.51,76.85 | SBRIO_MEZZANINE.237 91.36,66.77 | C12.1 63.68,58.46 5V_REG.P$2 | C12.1 66.38,58.46 67.11,59.18 67.11,61.21 66.47,61.85 C9.2 | SBRIO_AUX.P$50 SBRIO_AUX.P$48 SBRIO_AUX.P$46 SBRIO_AUX.P$44 SBRIO_AUX.P$42 SBRIO_AUX.P$40 SBRIO_AUX.P$38 SBRIO_AUX.P$36 SBRIO_AUX.P$34 SBRIO_AUX.P$32 | SBRIO_AUX.P$32 SBRIO_AUX.P$31 49.93,8.76 51.99,8.76 | SBRIO_AUX.P$29 51.87,8.89 51.99,8.76 | SBRIO_AUX.P$30 SBRIO_AUX.P$32 | 51.99,8.76 53.68,8.76 SBRIO_AUX.P$27 SBRIO_AUX.P$28 SBRIO_AUX.P$26 | SBRIO_AUX.P$26 SBRIO_AUX.P$25 | SBRIO_AUX.P$26 SBRIO_AUX.P$24 | SBRIO_AUX.P$24 SBRIO_AUX.P$23 | SBRIO_AUX.P$24 SBRIO_AUX.P$22 | SBRIO_AUX.P$22 SBRIO_AUX.P$21 | SBRIO_AUX.P$22 60.03,10.89 60.12,10.79 61.71,10.79 SBRIO_AUX.P$20 SBRIO_AUX.P$18 SBRIO_AUX.P$17 | SBRIO_AUX.P$17 SBRIO_AUX.P$15 SBRIO_AUX.P$13 | SBRIO_AUX.P$17 63.74,8.89 | 63.74,8.89 SBRIO_AUX.P$19 | SBRIO_AUX.P$13 SBRIO_AUX.P$17 | 63.74,8.89 63.68,10.79 | SBRIO_ANALOG.P$13 66.03,26.04 63.68,26.04 61.81,27.91 SBRIO_ANALOG.P$19 | SBRIO_AUX.P$13 SBRIO_AUX.P$11 SBRIO_AUX.P$9 SBRIO_AUX.P$7 | SBRIO_ANALOG.P$13 SBRIO_ANALOG.P$16
  Top 0.406: SBRIO_ANALOG.P$10 SBRIO_ANALOG.P$7 71.52,25.78 70.03,25.78 67.81,28 SBRIO_ANALOG.P$13 | SBRIO_ANALOG.P$19 SBRIO_ANALOG.P$22 | SBRIO_ANALOG.P$25 SBRIO_ANALOG.P$26 | SBRIO_ANALOG.P$25 57.84,26.04 57.96,26.04 59.77,26.04 SBRIO_ANALOG.P$19 | SBRIO_ANALOG.P$25 SBRIO_ANALOG.P$27 SBRIO_ANALOG.P$29 SBRIO_ANALOG.P$31 SBRIO_ANALOG.P$33 SBRIO_ANALOG.P$35 SBRIO_ANALOG.P$37 SBRIO_ANALOG.P$39 SBRIO_ANALOG.P$41 SBRIO_ANALOG.P$43 SBRIO_ANALOG.P$45 SBRIO_ANALOG.P$47 SBRIO_ANALOG.P$49
  Top 0.61: IC1.6 22.02,53.98 | IC1.2 22.15,48.9 22.02,49.02 | IC3.6 22.28,40.77 22.02,40.51 | IC3.2 22.15,35.69 v22.02,35.81 | IC2.2 49.96,56.01 51.1,57.15 53.9,57.15 55.04,56.01 55.04,55.12 | IC2.6 55.04,55.12 | 55.04,55.12 v58.22,58.29
  Top 0.813: 22.42,76.71 21.89,76.71 v20.65,76.71 | v20.65,76.71 20.65,77.11 23.29,79.76 28.12,79.76 33.32,79.76 37.9,79.76 42.85,79.76 70.09,79.76 SHTDWN_CONN.9 78.76,74.72 R35.1 | v22.02,35.81 22.02,40.51 22.02,49.02 22.02,53.98 22.02,62.61 v24.82,65.41 | 22.02,75.34 v20.65,76.71
  Bottom 0.178: 64.82,27.3 64.82,29.08 SBRIO_ANALOG.P$16 | R9.1 66.64,24.95 66.64,26.73 67.81,27.9 SBRIO_ANALOG.P$13 | U1.P$2 32.18,34.67 v31.93,34.92
  Bottom 0.254: v80.7,25.65 80.7,27.18 SBRIO_ANALOG.P$1 | LEVEL_SHIFTER.7 94.75,54.66 85.14,64.26 85.14,67.94 88.57,71.37 88.57,75.44 89.84,76.71 v92.38,76.71 | 19.62,16.22 R1.2 19.74,18.29 v20.75,17.27 | 19.62,16.22 5225-3.3M5-TR(5).P$2 | 19.62,16.22 21.99,16.22 23.42,17.65 25.2,17.65 25.32,17.53 | C18.2 91.86,3.6 v92.4,3.05 | v8.43,35.81 8.43,35.69 13.89,35.69 | R8.1 5.37,67.06 R5.2 4.73,67.71 3.61,68.83 3.61,73.03 8.81,77.72 19.63,77.72 v20.65,76.71 | R18.1 55.81,25.92 SBRIO_ANALOG.P$25 | R17.1 61.81,25.83 | 61.81,25.83 SBRIO_ANALOG.P$19 | R14.1 61.81,25.64 61.81,25.83 | R10.1 64.82,27.3 | R7.1 20.62,72.52 20.88,72.26 | R6.1 20.75,70.99 20.88,70.87
  Bottom 0.406: v83.58,75.18 C14.1 85.31,74.51 v85.78,74.04 | 13.89,35.69 22.02,35.69
  Bottom 0.61: SHTDWN_CONN.9 75.23,74.68 77.77,72.14 77.77,69.72 77.65,69.6 77.35,69.6 66.22,58.46 63.84,58.46 5V_REG.P$2 v58.22,58.29 | 20.52,76.71 v20.65,76.71 | SBRIO_ANALOG.P$49 29.9,28.07 25.32,32.64
  Bottom 0.813: SHTDWN_CONN.10 77.67,72.18 SHTDWN_CONN.9 75.23,74.74 | v92.4,3.05 92.25,2.9 | 90.47,1.14 90.5,1.14 92.25,2.9 | 73.84,1.14 23.16,1.14 21.26,3.05 v20.65,3.05 20.65,3.07 25.32,7.75 25.32,17.53 25.32,32.64 25.32,32.89 22.53,35.69 22.02,35.69 v22.02,35.81 | 92.25,2.9 90.47,1.14 | 90.47,1.14 73.84,1.14 | 73.84,1.14 73.84,6.48 73.81,7.52 SBRIO_AUX.P$7 | v24.82,65.41 20.88,69.34 20.88,70.87 20.88,72.26 20.88,76.48 v20.65,76.71
  pour Bottom (isolate 0.254, rank 5): 0.18,81.15 101.52,81.15 101.52,0.13 0.18,0.13
  pour Top (isolate 0.254, rank 5): 0.3,81.03 101.52,81.15 101.52,0.13 0.18,0.13
IMD_OK_IN
  Bottom 0.254: R2.1 18.32,15.97 5225-3.3M5-TR(5).P$1 14.53,15.24 ACCUMULATOR_CONN.8
IMD_OUT
  Top 0.61: IC3.14 TUB_CONN.5
LAP_TIMER_IN
  Bottom 0.178: U1.P$8 35.5,34.17 34.47,33.15 31.8,33.15 27.48,37.47 16.81,37.47 14.78,39.5 14.78,41.78 13.39,43.18 7.29,43.18 6.78,43.69 6.78,46.48 7.54,47.24 9.83,47.24 TUB_CONN.2 12.35,49.52 R36.2
LATCH_OK
  Top 0.254: R5.1 5.78,66.8 5525-3.3YM5-TR(2).P$1 6.64,68.18 AIO_PO_CONN.8
N$3
  Bottom 0.305: AIO_PO_CONN.9 F15.2
N$4
  Top 0.254: 5238B-7-F.P$2 72.6,21.62 72.95,21.97 73.46,21.97 73.96,22.48 73.96,24.13 76.38,26.54 82.35,26.54 83.87,28.07 83.87,29.21 83.24,29.84 82.62,29.84 R13.2
  Top 0.406: R13.2 80.01,29.86 SBRIO_ANALOG.P$2
N$6
  Bottom 0.305: AIO_PO_CONN.10 11.23,64.39 15.02,64.39 F20.2
N$9
  Bottom 0.305: AIO_PO_CONN.11 F21.2
N$10
  Bottom 0.305: AIO_PO_CONN.12 11.23,61.85 14.39,61.85 F22.2
N$11
  Top 0.813: SHTDWN_CONN.5 67.67,72.18 SHTDWN_CONN.6 66.59,70.75 F1.2
N$37  (via drill 0.38)
  Top 0.406: GYRO.14 86.03,71.7 v84.79,71.79
  Bottom 0.406: v84.79,71.79 87.05,73.6 87.05,75.14 C14.2 C13.2
N$38  (via drill 0.5)
  Top 0.406: R35.2 v82.82,78.99
  Bottom 0.406: v82.82,78.99 C13.1
N$41
  Top 0.813: BSPD_CONN.10 51.44,70.63 F6.1
  Bottom 1.651: BSPD_CONN.9 50.49,72.18 BSPD_CONN.10
N$54
  Top 0.254: 4403-7-F.P$2 79.31,21.05 R11.2
N$56
  Top 0.254: 4403-7-F.P$1 83.49,18.68 F17.2
N$57
  Top 0.254: 4403-7-F(2).P$1 73.71,14.88 F18.2
N$58
  Top 0.254: R12.2 76.12,18.21 4403-7-F(2).P$2
N$60
  Top 0.254: R15.2 75.49,22.61 75.11,22.99 74.8,22.99 4401-7-F(1).P$2
N$61
  Top 0.254: 4401-7-F(1).P$1 74.73,20.08 R12.1
N$62
  Top 0.254: 82.54,25.07 R16.2 82.95,25 4401-7-F(2).P$2
N$63
  Top 0.254: R11.1 80.58,22.89 4401-7-F(2).P$1
PO2
  Top 0.61: AIO_PO_CONN.15 12.5,54.74 15.93,51.44 IC1.17
PO3  (via drill 0.5)
  Top 0.61: v14.53,55.24 IC1.14
  Bottom 0.305: 11.23,59.31 11.23,56.9
  Bottom 0.61: AIO_PO_CONN.14 11.23,59.31 | 11.23,56.9 11.23,56.13 12.12,55.24 v14.53,55.24
PO4
  Top 0.61: IC1.13 16.31,56.52 12.5,60.33 AIO_PO_CONN.13 12.5,60.71
SHIELD  (via drill 0.6)
  Top 0.178: 30.4,19.68 32.94,19.68
  Top 0.254: SBRIO_CAN.P$5 32.94,19.68 | 30.4,19.68 SBRIO_CAN.P$10 28.24,20.95 27.48,20.19 27.48,17.4 26.47,16.38 v23.93,16.38
  Bottom 0.254: v23.93,16.38 20.12,12.57 ACCUMULATOR_CONN.6
SHUTDOWN_1
  Top 0.406: IC2.17 52.5,65.66 53.9,67.06 53.91,67.82 F14.1
SHUTDOWN_1_FUSED
  Top 0.813: F14.2 56.72,70.75 SHTDWN_CONN.2 57.67,72.18 SHTDWN_CONN.1
SHUTDOWN_2
  Top 0.406: IC2.14 56.31,66.42 57.33,67.44 58.49,67.44 F2.1
SHUTDOWN_2_FUSED
  Top 0.813: SHTDWN_CONN.3 62.67,72.18 SHTDWN_CONN.4 61.59,70.75 F2.2
SHUTDOWN_3
  Top 0.406: IC2.13 57.58,65.91 58.34,66.67 60.12,66.67 61.52,68.07 64.33,68.07 F1.1
STEERING_POS  (via drill 0.5)
  Top 0.254: TUB_CONN.16 9.99,29.34 | 23.04,16.64 23.04,16.76 v19.23,20.57
  Top 0.305: 23.04,16.64 23.04,11.81 27.1,7.75 40.69,7.75 41.81,8.86 SBRIO_AUX.P$39
  Bottom 0.178: 42.85,11.68 42.85,9.93 | R17.2 60.52,23.24 59.81,23.24
  Bottom 0.254: SBRIO_ANALOG.P$21 59.81,23.24 59.81,15.81 58.6,14.61 45.77,14.61 42.85,11.68 | 42.85,9.93 SBRIO_AUX.P$39 | v19.23,20.57 18.72,20.57 TUB_CONN.16
THROTTLE_IN_1
  Top 0.254: R20.2 8.32,34.02 9.32,33.02 11.35,33.02 TUB_CONN.13
  Top 0.305: TUB_CONN.13 13.13,31.24 14.02,31.24 15.67,29.59 27.61,29.59 30.53,32.51 61.39,32.51 63.81,30.1 SBRIO_ANALOG.P$18
THROTTLE_IN_2
  Top 0.254: SBRIO_ANALOG.P$20 59.99,31.88 30.78,31.88 27.86,28.96 | 11.23,30.61 TUB_CONN.14 9.7,31.62 R21.2
  Top 0.305: 27.86,28.96 15.16,28.96 13.51,30.61 11.23,30.61
THROTTLE_OK_OUT
  Top 0.406: F6.2 51.23,67.42 IC2.18
WS1
  Bottom 0.254: LEVEL_SHIFTER.13 100.6,50.39 99.84,50.39 99.27,49.82 99.27,48.2 98.76,47.69 98.76,15.68 98.73,15.62 98.6,15.49 WHEEL.1
WS2
  Bottom 0.254: WHEEL.2 96.54,11.21 96.54,14.13 98.28,15.88 98.28,47.88 98.79,48.39 98.79,50.01 99.84,51.05 100.6,51.05 LEVEL_SHIFTER.12
WS3
  Bottom 0.254: WHEEL.3 96.06,14.32 97.81,16.07 97.81,48.07 98.32,48.58 98.32,50.83 99.17,51.69 LEVEL_SHIFTER.11
WS4
  Bottom 0.254: LEVEL_SHIFTER.10 98.49,52.34 97.84,51.69 97.84,48.77 97.33,48.26 97.33,16.26 94.79,13.72 WHEEL.4

## Text on the board
bPlace: sbRIO Daughter Card v5 / FSAE Electric 2016 | Layout By: Michael DeLay | Design By: Thomas Willson & Michael DeLay
bBMP: /Users/thomaswillson/Google Drive/Cal Poly SAE General/Sponsorships and Promotions/Logos and Marks/2015 Cal Poly Racing Logo/PCB/CPRacingSLO-BW-Final-PCB-3in-Inverted.bmp